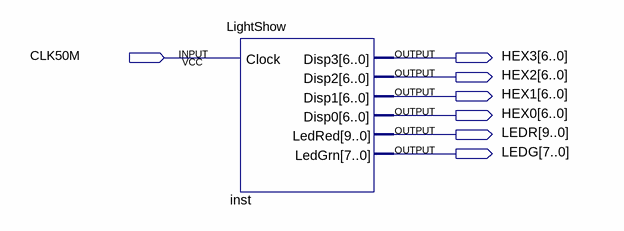
[diagram p0: schematic sheet]
// Quartus schematic DancingStateMachine.bdf as structural Verilog: 1 symbols, 7 pins
module DancingStateMachine (
  input  CLK50M,
  output [6:0] HEX3,
  output [6:0] HEX2,
  output [6:0] HEX1,
  output [6:0] HEX0,
  output [9:0] LEDR,
  output [7:0] LEDG
);

  LightShow inst (.Clock(CLK50M), .Disp3(HEX3), .Disp2(HEX2), .Disp1(HEX1), .Disp0(HEX0), .LedRed(LEDR), .LedGrn(LEDG));
endmodule
